# Altium schematic sheet PSU_VCC2V5_Buck.SchDoc
size A3; SheetNumber: 10; SheetTotal: 32
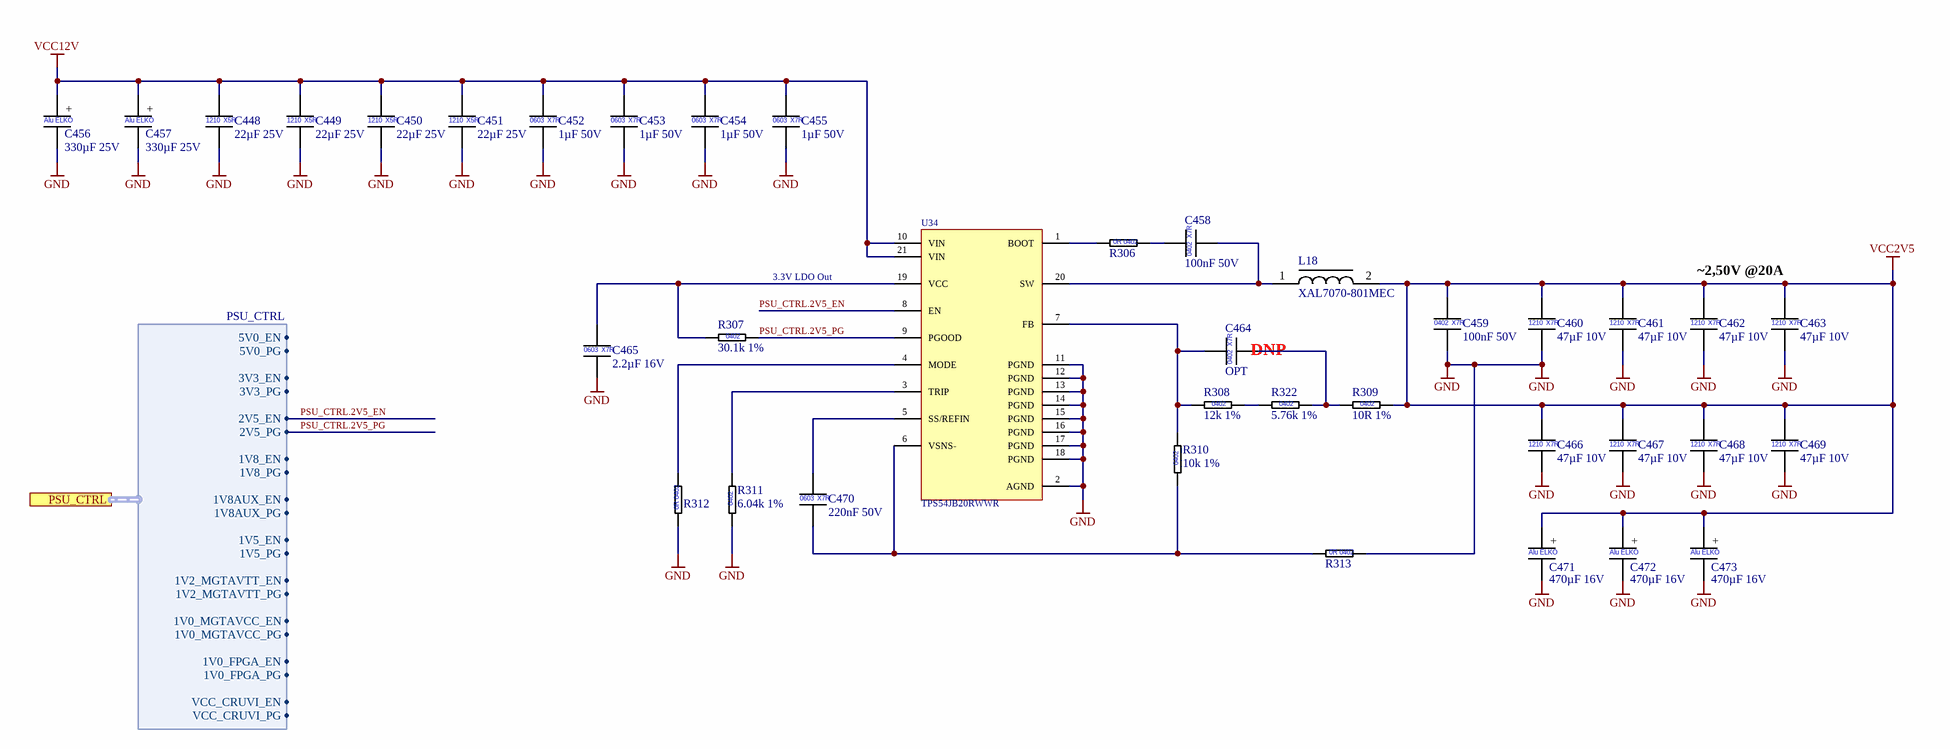
[diagram p0: PSU_VCC2V5_Buck.SchDoc]

## Parts
C448  22µF 25V  [CAP_1210]
C449  22µF 25V  [CAP_1210]
C450  22µF 25V  [CAP_1210]
C451  22µF 25V  [CAP_1210]
C452  1µF 50V  [CAP_0603]
C453  1µF 50V  [CAP_0603]
C454  1µF 50V  [CAP_0603]
C455  1µF 50V  [CAP_0603]
C456  330µF 25V  [WCAP-PTG5_D10H12.5]
C457  330µF 25V  [WCAP-PTG5_D10H12.5]
C458  100nF 50V  [CAP_0402]
C459  100nF 50V  [CAP_0402]
C460  47µF 10V  [CAP_1210]
C461  47µF 10V  [CAP_1210]
C462  47µF 10V  [CAP_1210]
C463  47µF 10V  [CAP_1210]
C464  OPT  [CAP_0402]  (no BOM)
C465  2.2µF 16V  [CAP_0603]
C466  47µF 10V  [CAP_1210]
C467  47µF 10V  [CAP_1210]
C468  47µF 10V  [CAP_1210]
C469  47µF 10V  [CAP_1210]
C470  220nF 50V  [CAP_0603]
C471  470µF 16V  [WCAP-PTG5_D8H13]
C472  470µF 16V  [WCAP-PTG5_D8H13]
C473  470µF 16V  [WCAP-PTG5_D8H13]
L18  XAL7070-801MEC  [COILCRAFT_XAL7070]
R306  0R Jumper  [RES_0402]  (value not drawn)
R307  30.1k 1%  [RES_0402]
R308  12k 1%  [RES_0402]
R309  10R 1%  [RES_0402]
R310  10k 1%  [RES_0402]
R311  6.04k 1%  [RES_0402]
R312  0R Jumper  [RES_0402]  (value not drawn)
R313  0R Jumper  [RES_0402]  (value not drawn)
R322  5.76k 1%  [RES_0402]
U34  TPS54JB20RWWR  [VQFN-HR21_RWW0021A]

## Ports
PSU_CTRL (harness PSU_CTRL, see Power-Tree[2C], PSU_MGTAVCC_Buck[1B], PSU_MGTAVTT_Buck[1B], PSU_VCC1V0_FPGA_Buck[1B], PSU_VCC1V5_Buck[1B], PSU_VCC1V8_Buck[1B], PSU_VCC1V8AUX_Buck[1B], PSU_VCC3V3_Buck[1B], PSU_VCC5V_Buck[1B], PSU_VCC_CRUVI_ADJ_Buck[1B])

## Harnesses
PSU_CTRL: 5V0_EN, 5V0_PG, 3V3_EN, 3V3_PG, 2V5_EN, 2V5_PG, 1V8_EN, 1V8_PG, 1V8AUX_EN, 1V8AUX_PG, 1V5_EN, 1V5_PG, 1V2_MGTAVTT_EN, 1V2_MGTAVTT_PG, 1V0_MGTAVCC_EN, 1V0_MGTAVCC_PG, 1V0_FPGA_EN, 1V0_FPGA_PG, VCC_CRUVI_EN, VCC_CRUVI_PG

## Nets
GND: C448.2 C449.2 C450.2 C451.2 C452.2 C453.2 C454.2 C455.2 C456.2 C457.2 C459.2 C460.2 C461.2 C462.2 C463.2 C465.2 C466.2 C467.2 C468.2 C469.2 C471.2 C472.2 C473.2 R311.1 R312.1 R313.2 U34.2(AGND) U34.11(PGND) U34.12(PGND) U34.13(PGND) U34.14(PGND) U34.15(PGND) U34.16(PGND) U34.17(PGND) U34.18(PGND)
VCC2V5: C459.1 C460.1 C461.1 C462.1 C463.1 C466.1 C467.1 C468.1 C469.1 C471.1 C472.1 C473.1 L18.2 R309.2
VCC12V: C448.1 C449.1 C450.1 C451.1 C452.1 C453.1 C454.1 C455.1 C456.1 C457.1 U34.10(VIN) U34.21(VIN)
PSU_CTRL.2V5_EN: U34.8(EN) ; port PSU_CTRL.2V5_EN
PSU_CTRL.2V5_PG: R307.2 U34.9(PGOOD) ; port PSU_CTRL.2V5_PG
NetC458_1: C458.1 R306.2
NetC458_2: C458.2 L18.1 U34.20(SW)
NetC464_1: C464.1 R308.1 R310.2 U34.7(FB)
NetC464_2: C464.2 R309.1 R322.2
NetC465_1: C465.1 R307.1 U34.19(VCC)
NetC470_1: C470.1 U34.5(SS/REFIN)
NetC470_2: C470.2 R310.1 R313.1 U34.6(VSNS-)
NetR306_1: R306.1 U34.1(BOOT)
NetR308_2: R308.2 R322.1
NetR311_2: R311.2 U34.3(TRIP)
NetR312_2: R312.2 U34.4(MODE)

## Notes on the sheet
- 3.3V LDO Out
- (near C463) ~2,50V @20A
- (near C464) DNP
- Company:
- Contact:
- Customer:
- mail@pcb-arts.com
- PCB Arts GmbH
- Title:
- Project:
- The  information  contained  in  these  documents  is  confidential,  privileged  and  only  for  the information of the intended recipient and may not be used, published or redistributed Without the prior written consent from PCB Arts GmbH.
- Engineer:
- Document Number:
- Revision:
- Variant:
- Date:
- Time:
- Sheet:
- Status:
- /
- (in symbol CAP_0402_100nF_50V) X7R; 0402
- (in symbol CAP_0402_OPT) X7R; 0402
- (in symbol CAP_0603_1µF_50V_X7R_10%) 0603; X7R
- (in symbol CAP_0603_2.2µF_16V_X7R_10%) 0603; X7R
- (in symbol CAP_0603_220nF_50V_X7R_10%) 0603; X7R
- (in symbol CAP_1210_22µF_25V) 1210; X5R
- (in symbol CAP_1210_47µF_10V_X7R_10%) 1210; X7R
- (in symbol CAP_D8L9_470µF_16V) +; Alu ELKO
- (in symbol CAP_D10L12.5_330µF_25V) +; Alu ELKO
- (in symbol RES_0402_0R Jumper) 0R 0402
- (in symbol RES_0402_5.76k_1%) 0402
- (in symbol RES_0402_6.04k_1%) 0402
- (in symbol RES_0402_10k_1%) 0402
- (in symbol RES_0402_10R_1%) 0402
- (in symbol RES_0402_12k_1%) 0402
- (in symbol RES_0402_30.1k_1%) 0402

## Library data of the parts
C448-C451 = CAP_1210_22µF_25V: Multilayer Ceramic Capacitors MLCC - SMD/SMT 1210 25VDC; Manufacturer 1: KEMET; Manufacturer 1 Prt. Nr.: C1210C226K3PACTU; Manufacturer 2 Prt. Nr.: TMK212BBJ226MG-TT; Manufacturer 2: Taiyo Yuden
C452-C455 = CAP_0603_1µF_50V_X7R_10%: Multilayer Ceramic Capacitors MLCC - SMD/SMT 50V 1uF X7R 0603 10%; Manufacturer 1: KYOCERA AVX; Manufacturer 1 Prt. Nr.: 06035C105KAT2A; Manufacturer 2 Prt. Nr.: MSASU168AB7105KTNA01; Manufacturer 2: TAIYO YUDEN
C456 C457 = CAP_D10L12.5_330µF_25V: Organische Polymer-Aluminiumkondensatoren 330uF 25 Volts 20% AEC-Q200; Manufacturer 1: Würth Elektronik; Manufacturer 1 Prt. Nr.: 870025575009
C458 C459 = CAP_0402_100nF_50V: Multilayer Ceramic Capacitors MLCC - SMD/SMT 0402 50VDC; Manufacturer 1: Murata Electronics; Manufacturer 1 Prt. Nr.: GCM155L8EH104KE07D; Manufacturer 2 Prt. Nr.: UMK105B7104KV-FR; Manufacturer 2: TDK
C460-C463 C466-C469 = CAP_1210_47µF_10V_X7R_10%: Multilayer Ceramic Capacitors MLCC - SMD/SMT 47 uF 10 VDC 10% 1210 X7R; Manufacturer 1: Murata Electronics; Manufacturer 1 Prt. Nr.: GRM32ER71A476KE15L; Manufacturer 2 Prt. Nr.: C1210C106K8RACTU; Manufacturer 2: KEMET
C464 = CAP_0402_OPT: Multilayer Ceramic Capacitors MLCC - SMD/SMT 0402 Optional Placeholder
C465 = CAP_0603_2.2µF_16V_X7R_10%: Multilayer Ceramic Capacitors MLCC - SMD/SMT 2.2 uF 16 VDC 10% 0603 X7R; Manufacturer 1: Murata Electronics; Manufacturer 1 Prt. Nr.: GRM188Z71C225KE43D; Manufacturer 2 Prt. Nr.: EMK107BB7225KA-T; Manufacturer 2: TAIYO YUDEN
C470 = CAP_0603_220nF_50V_X7R_10%: Multilayer Ceramic Capacitors MLCC - SMD/SMT 0.22 uF 50 VDC 10% 0603 X7R; Manufacturer 1: Murata Electronics; Manufacturer 1 Prt. Nr.: GRJ188R71H224KE11D; Manufacturer 2 Prt. Nr.: CGA3E3X7R1H224K080AE; Manufacturer 2: TDK
C471-C473 = CAP_D8L9_470µF_16V: Organische Polymer-Aluminiumkondensatoren 470uF 16 Volts 20%; Manufacturer 1: Würth Elektronik; Manufacturer 1 Prt. Nr.: 870025374007
L18 = XAL7070-801MEC_Power Inductors SMD 800nH Shld 20% 25.8A 2.29mOhms AECQ200: Power Inductors - SMD 800nH Shld 20% 25.8A 2.29mOhms AECQ200; Manufacturer 1: Coilcraft; Manufacturer 1 Prt. Nr.: XAL7070-801MEC
R306 R312 R313 = RES_0402_0R Jumper: Thick Film Resistors - SMD 0Ohm; Manufacturer 1: Vishay / Dale; Manufacturer 1 Prt. Nr.: CRCW04020000Z0EDC; Manufacturer 2 Prt. Nr.: RC0402JR-070RL; Manufacturer 2: Yageo
R307 = RES_0402_30.1k_1%: Thick Film Resistors - SMD 30.1kOhm 1%; Manufacturer 1: Vishay / Dale; Manufacturer 1 Prt. Nr.: CRCW040230K1FKEDC; Manufacturer 2 Prt. Nr.: RC0402FR-1330K1L; Manufacturer 2: Yageo
R308 = RES_0402_12k_1%: Thick Film Resistors - SMD 12kOhm 1%; Manufacturer 1: Vishay / Dale; Manufacturer 1 Prt. Nr.: CRCW040212K0FKEDC; Manufacturer 2 Prt. Nr.: RC0402FR-7W12KL; Manufacturer 2: Yageo
R309 = RES_0402_10R_1%: Thick Film Resistors - SMD 10Ohm 1%; Manufacturer 1: Vishay / Dale; Manufacturer 1 Prt. Nr.: CRCW040210R0FKEE; Manufacturer 2 Prt. Nr.: RC0402FR-7W10RL; Manufacturer 2: Yageo
R310 = RES_0402_10k_1%: Thick Film Resistors - SMD 10kOhm 1%; Manufacturer 1: Vishay / Dale; Manufacturer 1 Prt. Nr.: CRCW040210K0FKEDC; Manufacturer 2 Prt. Nr.: RC0402FR-7W10KL; Manufacturer 2: Yageo
R311 = RES_0402_6.04k_1%: Thick Film Resistors - SMD 6.04kOhm 1%; Manufacturer 1: Vishay / Dale; Manufacturer 1 Prt. Nr.: CRCW04026K04FKEDC; Manufacturer 2 Prt. Nr.: RC0402FR-7W6K04L; Manufacturer 2: Yageo
R322 = RES_0402_5.76k_1%: Thick Film Resistors - SMD 5.76kOhm 1%; Manufacturer 1: Vishay / Dale; Manufacturer 1 Prt. Nr.: CRCW04025K76FKED; Manufacturer 2 Prt. Nr.: AC0402FR-075K76L; Manufacturer 2: Yageo
U34 = TPS54JB20RWWR_Switching Voltage Regulators 2.7-V to 16-V input 20-A synchronous Buck: Switching Voltage Regulators 2.7-V to 16-V input 20-A synchronous Buck; Manufacturer 1: Texas Instruments; Manufacturer 1 Prt. Nr.: TPS54JB20RWWR